# EAGLE design PRSC-2101-THCFM-1V3_eagle7 (EAGLE 9.5.0)
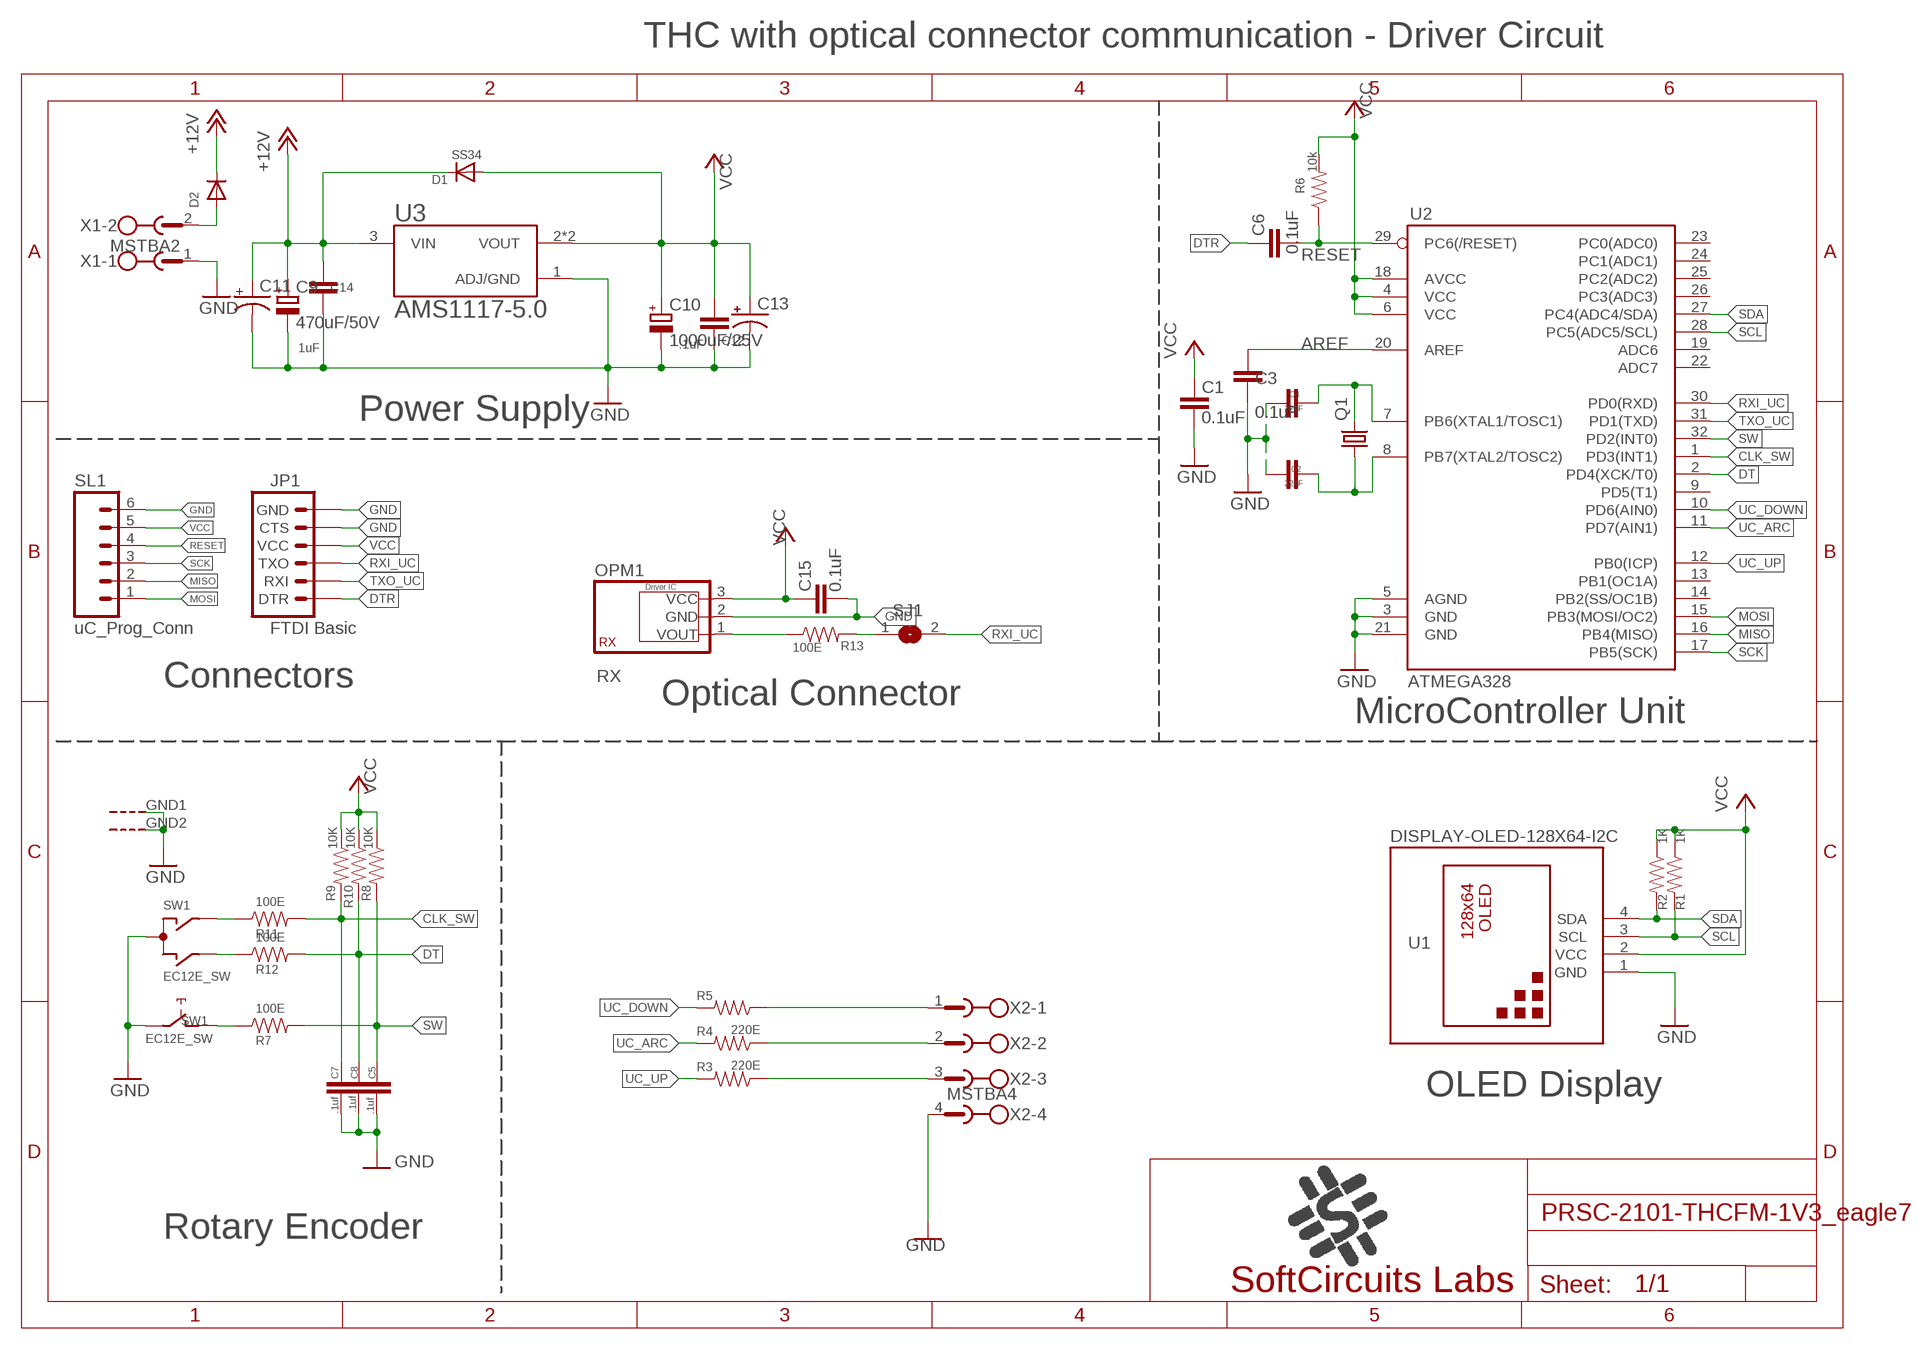
[diagram p0: schematic, sheet 1]

## Parts
C1  0.1uF  C-EUC1206  [C1206]
C2  22pF  C-EUC1206  [C1206]
C3  0.1uF  C-EUC1206  [C1206]
C4  22pF  C-EUC1206  [C1206]
C5  .1uf  C-EUC1206  [C1206]
C6  0.1uF  C-EUC1206  [C1206]
C7  .1uf  C-EUC1206  [C1206]
C8  .1uf  C-EUC1206  [C1206]
C9  470uF/50V  CPOL-EU153CLV-1010  [153CLV-1010]
C10  1000uF/25V  CPOL-EU153CLV-1010  [153CLV-1010]
C11  CAP_POL3528-KIT  [EIA3528-KIT]
C12  .1uF  CAP1206  [1206]
C13  CAP_POL3528-KIT  [EIA3528-KIT]
C14  1uF  CAP1206  [1206]
C15  0.1uF  C-EUC1206  [C1206]
D1  SS34  DIODESMA  [SMADIODE]
D2  DIODESMA  [SMADIODE]
JP1  FTDI Basic  ARDUINO_SERIAL_PROGRAMPTH  [1X06]
LOGO100  SC_LOGO  [SC_LOGO]
OPM1  RX  TOSLINK_DQR-025  [TOSLINK_DQ-025]
Q1  CRYSTALHC49UP  [HC49UP]
R1  1K  RESISTOR1206  [1206]
R2  1K  RESISTOR1206  [1206]
R3  220E  RESISTOR1206  [1206]
R4  220E  RESISTOR1206  [1206]
R5  220E  RESISTOR1206  [1206]
R6  10k  RESISTOR1206  [1206]
R7  100E  RESISTOR1206  [1206]
R8  10K  RESISTOR1206  [1206]
R9  10K  RESISTOR1206  [1206]
R10  10K  RESISTOR1206  [1206]
R11  100E  RESISTOR1206  [1206]
R12  100E  RESISTOR1206  [1206]
R13  100E  RESISTOR1206  [1206]
SJ1  SJ  [SJ]
SL1  uC_Prog_Conn  M06  [06P]
SW1  EC12E_SW  [ALPS_EC12E_SW]
U1  DISPLAY-OLED-128X64-I2C  [DISPLAY-OLED-128X64-I2C]
U2  ATMEGA328  ATMEGA168  [TQFP32-08]
U3  AMS1117-5.0  [SOT229P700X180-4N]
X1  MSTBA2  [MSTBA2]
X2  MSTBA4  [MSTBA4]

## Nets
+12V [power]: C9.+ C11.A(+) C14.1 D1.C D2.C U3.3(VIN)
AREF: C3.2 U2.20(AREF)
CLK_SW: C7.1 R9.2 R11.2 U2.1(PD3(INT1))
DT: C8.1 R10.2 R12.2 U2.2(PD4(XCK/T0))
DTR: C6.2 JP1.1(DTR)
GND: C1.1 C2.2 C3.1 C4.2 C5.2 C7.2 C8.2 C9.- C10.- C11.C(-) C12.2 C13.C(-) C14.2 C15.1 JP1.5(CTS) JP1.6(GND) OPM1.2(GND) SL1.6 SW1.C SW1.E SW1.GND1(G) SW1.GND2(G) U1.1(GND) U2.3(GND) U2.5(AGND) U2.21(GND) U3.1(ADJ/GND) X1.1 X2.4
MISO: SL1.2 U2.16(PB4(MISO))
MOSI: SL1.1 U2.15(PB3(MOSI/OC2))
N$1: R13.2 SJ1.1
N$2: R7.1 SW1.D
N$3: R12.1 SW1.B
N$5: R11.1 SW1.A
N$7: C4.1 Q1.2 U2.7(PB6(XTAL1/TOSC1))
N$8 [power]: D2.A X1.2
N$9: OPM1.1(VOUT) R13.1
N$10: C2.1 Q1.1 U2.8(PB7(XTAL2/TOSC2))
N$87: R5.1 X2.1
N$103: R3.1 X2.3
N$105: R4.1 X2.2
RESET: C6.1 R6.1 SL1.4 U2.29(PC6(/RESET))
RXI_UC: JP1.3(TXO) SJ1.2 U2.30(PD0(RXD))
SCK: SL1.3 U2.17(PB5(SCK))
SCL: R1.2 U1.3(SCL) U2.28(PC5(ADC5/SCL))
SDA: R2.2 U1.4(SDA) U2.27(PC4(ADC4/SDA))
SW: C5.1 R7.2 R8.2 U2.32(PD2(INT0))
TXO_UC: JP1.2(RXI) U2.31(PD1(TXD))
UC_ARC: R4.2 U2.11(PD7(AIN1))
UC_DOWN: R5.2 U2.10(PD6(AIN0))
UC_UP: R3.2 U2.12(PB0(ICP))
VCC: C1.2 C10.+ C12.1 C13.A(+) C15.2 D1.A JP1.4(VCC) OPM1.3(VCC) R1.1 R2.1 R6.2 R8.1 R9.1 R10.1 SL1.5 U1.2(VCC) U2.4(VCC) U2.6(VCC) U2.18(AVCC) U3.2(VOUT) U3.4(VOUT)
Unconnected: U2.9(PD5(T1)) U2.13(PB1(OC1A)) U2.14(PB2(SS/OC1B)) U2.19(ADC6) U2.22(ADC7) U2.23(PC0(ADC0)) U2.24(PC1(ADC1)) U2.25(PC2(ADC2)) U2.26(PC3(ADC3))

## Notes on the sheet
- THC with optical connector communication - Driver Circuit
- Power Supply
- Connectors
- Optical Connector
- MicroController Unit
- OLED Display
- Rotary Encoder
- SoftCircuits Labs

## Library data of the parts
C1-C8 C15 = SoftCircuits-Capacitors:C-EU: CAPACITOR, European symbol; SPICEPREFIX: C
C9 C10 = SoftCircuits-Capacitors:CPOL-EU: POLARIZED CAPACITOR, European symbol; SPICEPREFIX: C
C11 C13 = SparkFun-Capacitors:CAP_POL: Capacitor Polarized These are standard SMD and PTH capacitors. Normally 10uF, 47uF, and 100uF in electrolytic and tantalum varieties. Always verify the external diameter of the through hole cap, it varies with capacity, voltage, and manufacturer. The EIA devices should be standard.
C12 C14 = SparkFun-Capacitors:CAP: Capacitor Standard 0603 ceramic capacitor, and 0.1" leaded capacitor.
D1 D2 = adafruit:DIODE: Diode SMADIODE - SMA Surface Mount Package 20V 1A Schottky Diode Digikey: 641-1014-6-ND DO-1N4148 - Through Hole Small Current Diode SOD-123 20V 1 A (.5mV Vf) Schottky Diode - Digikey: MBRX120TPMSCT-ND SOD-323 10V 570mA (.38mV Vf, 3ns) Schottky Diode - Digikey: ZLLS410CT-ND SOD-523 30V 30mA Schottky Diode (RB751S-40TE61) - Digikey: RB751S-40TE61CT-ND SOT23-R/W - SOT23 Package (R = Solder Paste/Reflow Ovens, W = Hand-Soldering) BAT54Film 40V 300mA - Digikey: 497-7162-1-ND
JP1 = SparkFun:ARDUINO_SERIAL_PROGRAM
LOGO100 = _SoftCircuits_logo:SC_LOGO; SIZE: 150DPI
OPM1 = TOSLINK_Optical-modules:TOSLINK_DQR-025: DQR-025 General Purpose optical Receiving module
Q1 = adafruit:CRYSTAL: CRYSTAL; OC_FARNELL: unknown; OC_NEWARK: unknown
R1-R13 = SoftCircuits-Resistors:RESISTOR: Resistor Basic schematic elements and footprints for 0603, 1206, and PTH resistors.
SJ1 = jumper:SJ: SMD solder JUMPER
SL1 = con-amp-quick:M06: AMP QUICK CONNECTOR; OC_FARNELL: unknown; OC_NEWARK: unknown
SW1 = rotary-switch-alps:EC12E_SW: ALPS rotary Encoder EC12E series with switch; MPN: EC12E2424407; OC_FARNELL: 1520813; OC_NEWARK: 74M1068
U1 = diy-modules1.8:DISPLAY-OLED-128X64-I2C: 128x64 Dot Matrix OLED Module based on SSD1306 chip Variant with I2C interface More details available here: http://www.instructables.com/id/Monochrome-096-i2c-OLED-display-with-arduino-SSD13/ SSD1306 datasheet: https://cdn-shop.adafruit.com/datasheets/SSD1306.pdf Click here to find device on ebay.com <http://www.ebay.com/sch/oled+display+128x64+iic> Note: There are two variants: I2C and SPI. Search for the proper version.
U2 = SparkFun:ATMEGA168
U3 = AMS1117-5.0:AMS1117-5.0: Sot223/Pkg 1-Amp 5-Volt Low Drop Out Voltage Regulatator; AVAILABILITY: Unavailable; DESCRIPTION: Sot223/Pkg 1-Amp 5-Volt Low Drop Out Voltage Regulatator; MF: Advanced Monolithic Systems; MP: AMS1117-5.0; PACKAGE: None; PRICE: None
X1 = con-phoenix-508:MSTBA2: PHOENIX; MF: FARNELL; MPN: 1757242; OC_FARNELL: 3705171; OC_NEWARK: 71C4161
X2 = con-phoenix-508:MSTBA4: PHOENIX; MF: FARNELL; MPN: 1757268; OC_FARNELL: 3705195; OC_NEWARK: 71C4163

## Net classes
1 power: width 0.508 mm

## Board
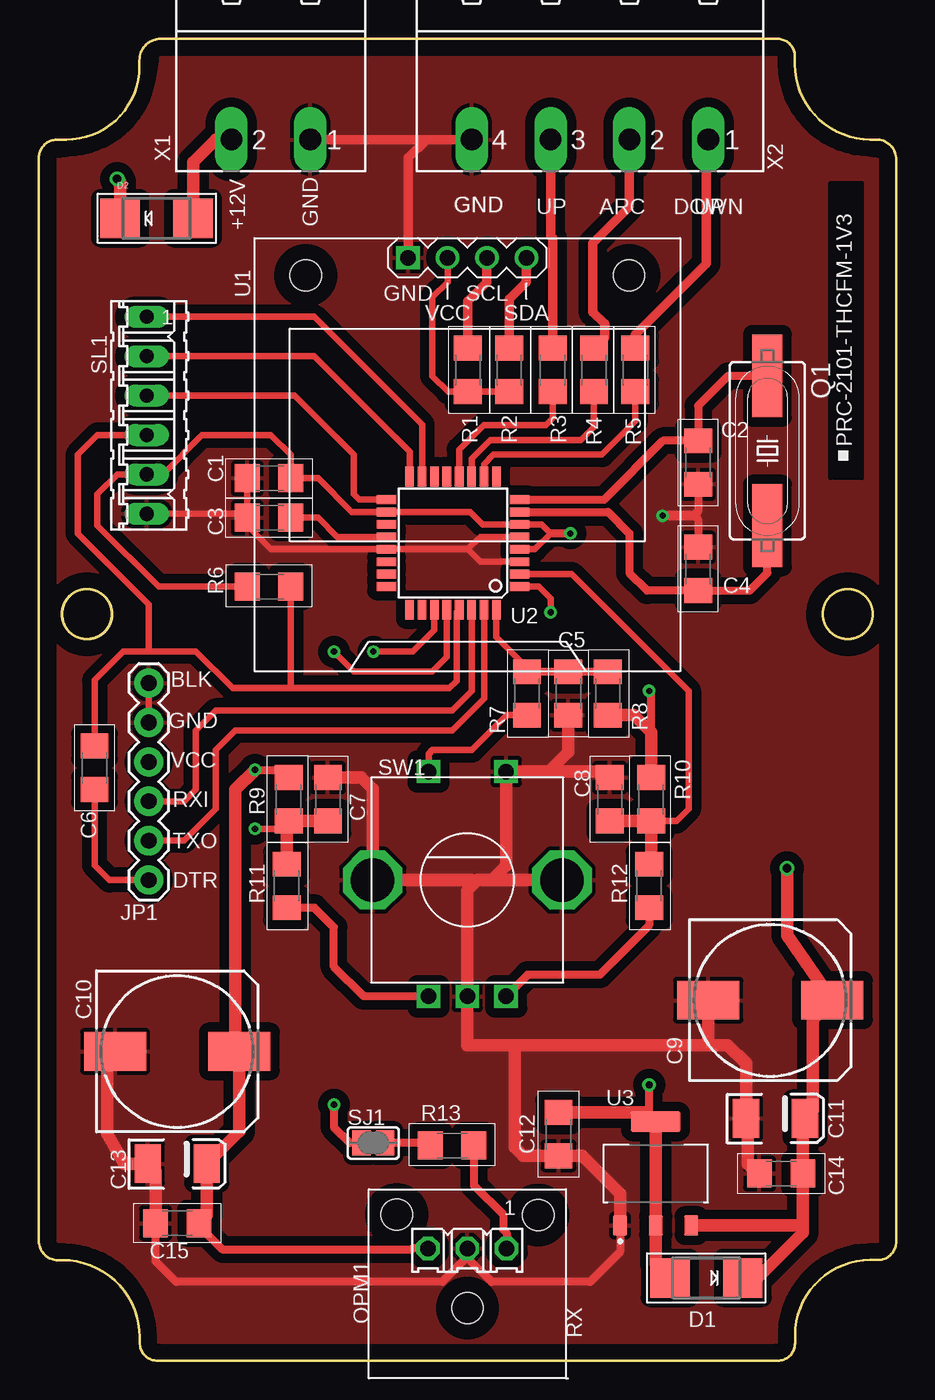
[diagram p1: board, top side]
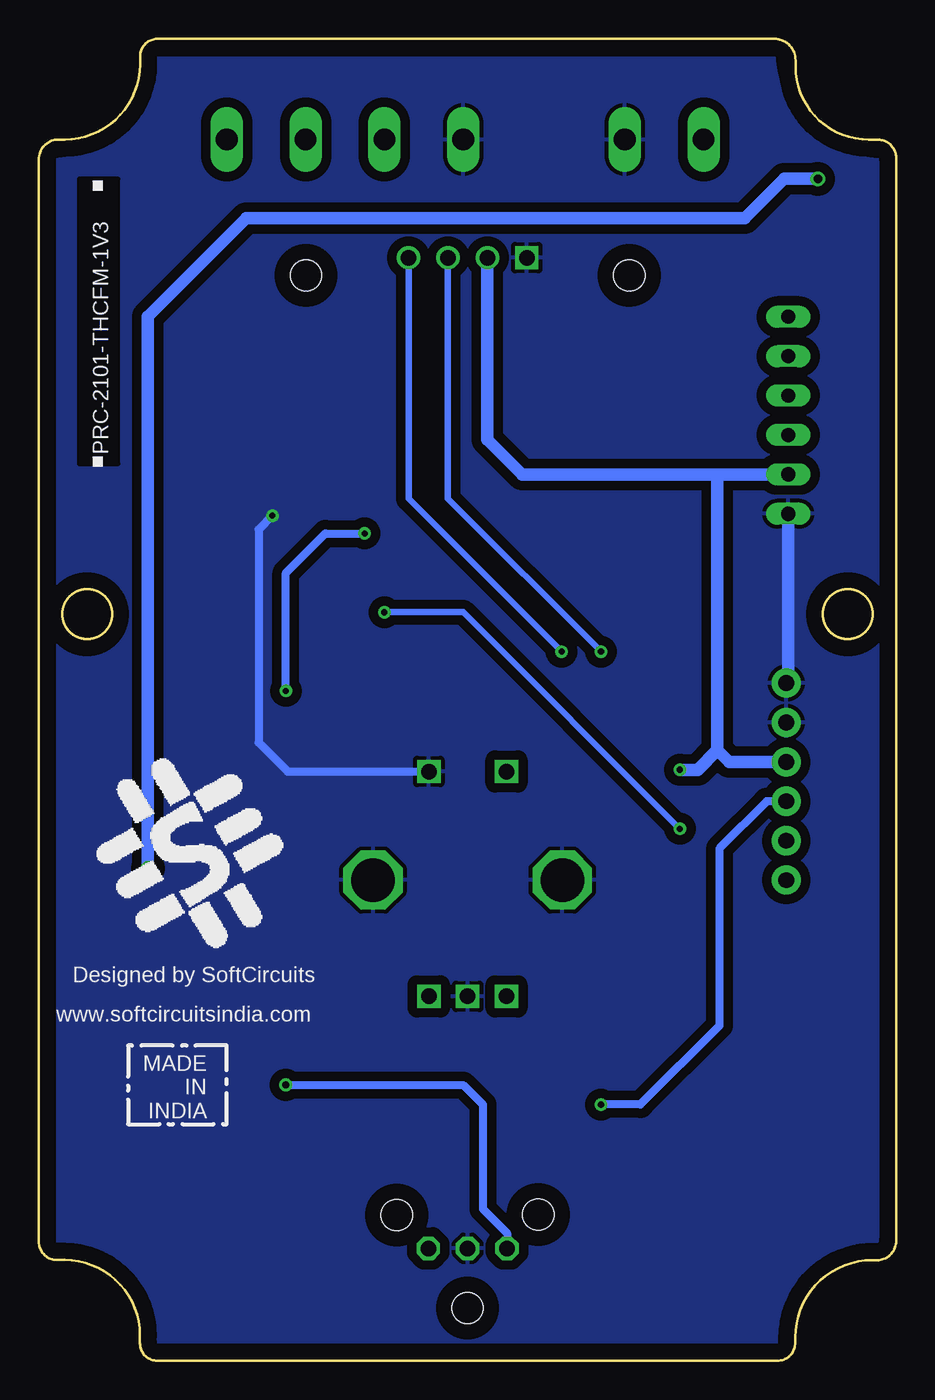
[diagram p2: board, bottom side, seen from below]

Size 55.27 x 85.25 mm. Coordinates in mm from the lower left corner, seen from the top.
Outline: 20.22,85.25 7.87,85.25 arc90 6.49,83.87 6.49,83.47 arc-90 1.76,78.74 1.19,78.74 arc90 0,77.56 0,7.72 arc90 1.23,6.48 1.52,6.48 arc-90 6.51,1.5 6.51,1.16 arc90 7.67,0 47.63,0 arc90 48.75,1.12 48.75,1.64 arc-90 53.6,6.5 54.09,6.5 arc90 55.27,7.67 55.27,77.47 arc90 53.99,78.75 53.59,78.75 arc-90 48.74,83.61 48.74,84.12 arc90 47.61,85.24 19.73,85.25
Outline: circle at 3.11,48.14 radius 1.6
Outline: circle at 52.15,48.14 radius 1.6
Copper layers (1*16): Top 0.035mm / dielectric 1.5mm / Bottom 0.035mm
Design rules "default": minimum track width 6mil, minimum drill 0.35mm, track to track 6mil, track to pad 6mil, pad to pad 6mil, via to via 6mil, smd to smd 6mil, copper to edge 40mil, drill to drill 6mil, minimum pad ring 10mil, minimum via ring 8mil, stop-mask expansion 4mil, vias tented up to drill 0mil, thermal gap 10mil
Holes 3.2 mm at 3.15,48.14 52.17,48.14

### Footprints (pad centres in the part's own frame; a part is rotated, then mirrored left to right if it is on the bottom)
C1206 = smd 1.6 x 1.8: 1 -1.4,0; 2 1.4,0
153CLV-1010 = smd 4 x 2.5: + 4,0; - -4,0
EIA3528-KIT = smd 1.7 x 2.5: A 1.9,0; C -1.9,0
1206 = smd 1.6 x 1.8: 1 -1.4,0; 2 1.4,0
SMADIODE = smd 2.54 x 2.54: A 2.349,0; C -2.349,0
1X06 = drill 1.016 pad 1.88: 1 0,0; 2 2.54,0; 3 5.08,0; 4 7.62,0; 5 10.16,0; 6 12.7,0
TOSLINK_DQ-025 = drill 1 octagon: 1 2.54,6.35; 2 0,6.35; 3 -2.54,6.35 | hole 2: -4.547,8.534; 4.572,8.509; 0,2.515
HC49UP = smd 5.334 x 1.93: 1 -4.826,0; 2 4.826,0
SJ = smd 1.168 x 1.6: 1 -0.762,0; 2 0.762,0
06P = drill 0.914 long: 1 -6.35,0; 2 -3.81,0; 3 -1.27,0; 4 1.27,0; 5 3.81,0; 6 6.35,0
ALPS_EC12E_SW = drill 1 square: A -2.5,-7.5; B 2.5,-7.5; C 0,-7.5; D -2.5,7; E 2.5,7 | drill 2.8 octagon: GND1 -6.1,0; GND2 6.1,0
DISPLAY-OLED-128X64-I2C = drill 1 square: 1 -3.81,12.7 | drill 1: 2 -1.27,12.7; 3 1.27,12.7; 4 3.81,12.7 | hole 2: -10.414,11.557; 10.414,11.557
TQFP32-08 = smd 1.27 x 0.559: 1 -4.293,2.8; 2 -4.293,2; 3 -4.293,1.2; 4 -4.293,0.4; 5 -4.293,-0.4; 6 -4.293,-1.2; 7 -4.293,-2; 8 -4.293,-2.8; 17 4.293,-2.8; 18 4.293,-2; 19 4.293,-1.2; 20 4.293,-0.4; 21 4.293,0.4; 22 4.293,1.2; 23 4.293,2; 24 4.293,2.8 | smd 0.559 x 1.27: 9 -2.8,-4.293; 10 -2,-4.293; 11 -1.2,-4.293; 12 -0.4,-4.293; 13 0.4,-4.293; 14 1.2,-4.293; 15 2,-4.293; 16 2.8,-4.293; 25 2.8,4.293; 26 2,4.293; 27 1.2,4.293; 28 0.4,4.293; 29 -0.4,4.293; 30 -1.2,4.293; 31 -2,4.293; 32 -2.8,4.293
SOT229P700X180-4N = smd 0.93 x 1.31: 1 -2.29,-3.345; 2 0,-3.345; 3 2.29,-3.345 | smd 3.24 x 1.31: 4 0,3.345
MSTBA2 = drill 1.397 long: 1 -2.54,5.08; 2 2.54,5.08
MSTBA4 = drill 1.397 long: 1 -7.62,5.08; 2 -2.54,5.08; 3 2.54,5.08; 4 7.62,5.08

### Placement (x,y rotation side)
C1  14.83,56.9 0 top
C2  42.5,57.92 270 top
C3  14.83,54.36 0 top
C4  42.5,51.06 90 top
C5  34.14,43.03 270 top
C6  3.59,38.23 270 top
C7  18.64,36.2 90 top
C8  36.8,36.2 90 top
C9  47.15,23.25 0 top
C10  8.93,19.95 0 top
C11  47.49,15.63 0 top
C12  33.5,14.61 270 top
C13  8.93,12.71 0 top
C14  47.86,12.07 180 top
C15  8.93,8.87 0 top
D1  43.03,5.34 180 top
D2  7.59,73.67 0 top
JP1  7.09,31 90 top
LOGO100  45.07,33.03 180 bottom
OPM1  27.62,0.9 0 top
Q1  46.96,58.68 270 top
R1  27.66,63.89 90 top
R2  30.33,63.89 90 top
R3  33.12,63.89 270 top
R4  35.79,63.89 270 top
R5  38.45,63.89 270 top
R6  14.83,49.92 180 top
R7  31.47,43.03 90 top
R8  36.68,43.03 90 top
R9  16.1,36.2 270 top
R10  39.47,36.2 270 top
R11  15.98,30.61 90 top
R12  39.34,30.61 90 top
R13  26.64,13.88 180 top
SJ1  21.56,14.04 180 top
SL1  6.96,60.97 270 top
SW1  27.62,31 0 top
U1  27.62,58.43 0 top
U2  26.7,52.73 180 top
U3  39.76,12.07 0 top
X1  14.96,83.83 180 top
X2  35.53,83.83 180 top

### Tracks (layer width: path | path; a pad name or v marks a point on that pad's centre or on a via)
+12V  (via drill 0.55)
  Top 0.813: v48.23,31.76 48.23,27.44 C9.+ 49.88,21.98 49.88,16.12 C11.A 49.26,15.5 C14.1 49.26,8.9 | D1.C 46.34,5.34 49.26,8.26 49.26,8.9 | U3.3 49.09,8.73 49.26,8.9 | D2.C 5.25,76.02 v5.05,76.21
  Bottom 0.813: v48.23,31.76 48.23,67.32 41.88,73.67 9.75,73.67 7.21,76.21 v5.05,76.21
AREF
  Top 0.406: U2.20 19.25,53.13 18.01,54.36 C3.2
CLK_SW  (via drill 0.4)
  Top 0.406: U2.1 32.22,49.93 32.99,49.16 v32.99,48.27 | 15.98,34.3 v13.94,34.3
  Top 0.813: C7.1 R9.2 15.98,34.67 15.98,34.3 R11.2
  Bottom 0.406: v32.99,48.27 27.91,48.27 v13.94,34.3
DT
  Top 0.406: U2.2 34.34,50.73 41.88,43.19 41.88,35.57 41.12,34.8 R10.2
  Top 0.813: C8.1 R10.2 39.47,32.14 R12.2
DTR
  Top 0.406: JP1.1 4.55,31 3.59,31.95 C6.2
GND  (via drill 0.4)
  Top 0.406: JP1.6 JP1.5 | SL1.6 13.43,54.62 C1.1 C3.1 13.43,53.86 14.96,52.33 U2.21 27.66,52.33 | U2.3 28.46,51.53 27.66,52.33 | U2.5 28.46,53.13 27.66,52.33
  Top 0.508: 40.28,54.49 v40.21,54.49 | 7.53,10.17 7.53,6.42 8.86,5.09 26.01,5.09 27.62,6.7 OPM1.2 27.62,6.65 29.18,5.09 35.53,5.09 37.47,7.03 U3.1 | C2.2 42.5,54.74 42.37,54.62 | 42.25,54.49 42.5,54.24 C4.2
  Top 0.61: 42.37,54.62 42.25,54.49 v40.21,54.49 | C4.2 42.24,52.46 | U1.1 23.81,77.57 24.99,78.75 | X1.1 24.99,78.75 | 24.99,78.75 X2.4
  Top 0.813: C5.2 34.14,39.25 32.88,37.99 | 32.88,37.99 SW1.E 30.12,31.93 29.18,30.99 | C8.2 36.42,37.99 32.89,37.99 32.88,37.99 | C7.2 20.8,37.6 21.52,36.88 SW1.GND1 27.86,31 28.28,30.97 | 29.18,30.99 28.3,30.99 28.28,30.97 | 28.28,30.97 27.62,30.32 SW1.C 27.62,20.33 30.67,20.33 | C14.2 46.33,12.07 45.69,12.71 45.69,15.52 C11.C 45.59,19.16 44.42,20.33 43.15,20.33 | U3.1 37.47,10.77 35.03,13.21 C12.2 31.22,13.21 30.67,13.76 30.67,20.33 | 43.15,20.33 30.67,20.33 | C9.- 43.15,20.33 | C10.- 4.42,19.44 4.42,14.62 5.5,12.71 C13.C 7.53,12.21 7.53,10.17 C15.1 | SW1.GND2 29.18,30.99
  Bottom 0.508: v40.21,54.49 41.1,53.6 41.1,39.87 39.23,37.99 SW1.E
  Bottom 0.813: SL1.6 6.96,43.82 JP1.6
  pour Top (isolate 0.61): 0.86,7.12 arc-90 7.34,0.64 47.85,0.64 arc-90 54.58,7.37 54.58,77.48 arc-90 47.6,84.46 7.85,84.46 arc-90 0.86,77.48
  pour Bottom (isolate 0.61): 0.86,7.12 arc-90 7.34,0.64 47.85,0.64 arc-90 54.58,7.37 54.58,77.48 arc-90 47.6,84.46 7.85,84.46 arc-90 0.86,77.48
MISO
  Top 0.406: SL1.2 17.75,64.78 23.9,58.63 U2.16
MOSI
  Top 0.406: U2.15 24.7,60.37 17.75,67.32 SL1.1
N$1
  Top 0.508: R13.2 25.09,14.04 SJ1.1
N$2
  Top 0.406: SW1.D 25.12,39.12 25.37,39.38 27.91,39.38 30.16,41.63 R7.1
N$3
  Top 0.508: R12.1 39.34,28.07 36.16,24.89 31.52,24.89 SW1.B
N$4
  cutout Bottom: 52.68,76.21 52.68,57.83 50.14,57.83 50.14,76.21
N$5
  Top 0.508: SW1.A 20.94,23.5 19.02,25.41 19.02,27.95 17.76,29.21 R11.1
N$6
  cutout Top: 51.03,56.9 51.03,75.95 53.06,75.95 53.06,56.9
N$7
  Top 0.508: U2.7 36.69,54.73 38.07,53.35 38.07,50.81 39.22,49.66 C4.1 45.82,49.66 46.96,50.81 Q1.2
N$8
  Top 0.813: X1.2 11.4,78.75 9.94,77.29 D2.A
N$9
  Top 0.508: R13.1 28.04,11.31 29.92,9.43 29.92,8.46 30.16,8.23 OPM1.1
N$10
  Top 0.508: U2.8 36.44,55.53 40.24,59.32 C2.1 42.5,61.58 44.42,63.51 Q1.1
N$87
  Top 0.61: R5.1 38.45,66.17 43.03,70.75 43.03,78.62 X2.1
N$103
  Top 0.61: R3.1 33.12,72.4 32.99,72.52 X2.3
N$105
  Top 0.61: R4.1 36.48,65.98 36.48,66.86 35.71,67.63 35.71,72.07 38.07,74.43 X2.2
RESET
  Top 0.406: U2.29 26.94,48.27 26.94,43.84 26.46,43.37 16.23,43.37 | 16.23,43.37 12.49,43.37 10.13,45.73 7.09,45.73 | 7.09,45.73 5.44,45.73 3.59,43.89 C6.1 | R6.1 16.23,43.37 | SL1.4 3.78,59.7 2.51,58.43 2.51,53.35 7.09,48.77 7.09,45.73
RXI_UC  (via drill 0.4)
  Top 0.406: U2.30 27.9,43.18 26.64,41.92 11.4,41.92 10.13,40.65 10.13,36.84 9.37,36.07 JP1.3
  Top 0.508: SJ1.2 20.04,14.04 19.02,15.06 v19.02,16.52
  Bottom 0.508: JP1.3 8.36,36.07 11.4,33.03 11.4,21.6 16.48,16.52 v19.02,16.52
SCK
  Top 0.406: SL1.3 16.48,62.24 20.29,58.43 20.29,55.89 20.66,55.53 U2.17
SCL  (via drill 0.4)
  Top 0.406: U2.28 26.3,45.39 25.37,44.46 20.29,44.46 v19.02,45.73
  Top 0.61: U1.3 28.89,69.57 27.66,68.33 R1.2
  Bottom 0.406: U1.3 28.89,55.59 v19.02,45.73
SDA  (via drill 0.4)
  Top 0.406: U2.27 25.5,47.13 24.1,45.73 v21.56,45.73
  Top 0.61: U1.4 31.43,69.57 30.33,68.46 R2.2
  Bottom 0.406: v21.56,45.73 31.43,55.59 U1.4
SW
  Top 0.406: U2.32 29.5,46.68 31.47,44.71 R7.2
  Top 0.508: R8.2 C5.1 R7.2
TXO_UC
  Top 0.406: U2.31 28.7,42.71 26.64,40.65 12.67,40.65 11.4,39.38 11.4,35.57 9.37,33.53 JP1.2
UC_ARC
  Top 0.406: U2.11 27.9,58.16 29.11,59.37 34.95,59.37 35.79,60.2 R4.2
UC_DOWN
  Top 0.406: U2.10 28.7,57.82 29.31,58.43 36.3,58.43 38.45,60.59 R5.2
UC_UP
  Top 0.406: U2.12 27.1,58.76 28.68,60.33 32.68,60.33 33.12,60.77 R3.2
VCC  (via drill 0.4, 0.45)
  Top 0.406: R2.1 R1.1 26.39,62.49 25.37,63.51 25.37,68.59 26.35,69.57 U1.2 | U2.4 31.97,52.33 32.99,53.35 32.41,53.93 U2.6 28.61,53.93 27.8,54.73 U2.18 20.18,54.73 18.01,56.9 C1.2 16.23,58.43 14.96,59.7 10.52,59.7 7.97,57.16 SL1.5 5.05,57.16 3.78,55.89 3.78,53.85 7.72,49.92 R6.2
  Top 0.508: v13.94,38.11 15.6,38.11 R9.1 | 39.47,40.52 39.47,43.06 v39.34,43.19 | v34.26,53.35 32.99,53.35 | OPM1.3 24.1,7.25 24.02,7.16 11.87,7.16 10.33,8.7 C15.2 | U3.4 39.34,15.84 v39.34,17.79
  Top 0.813: R8.1 38.36,41.63 39.47,40.52 R10.1 | D1.A 39.76,6.25 U3.2 U3.4 39.17,16.01 C12.1 | C15.2 10.83,9.37 C13.A 12.93,14.81 C10.+ 12.67,20.2 12.67,36.84 v13.94,38.11
  Bottom 0.508: v39.34,43.19 39.34,50.81 36.8,53.35 v34.26,53.35 | 11.34,57.09 11.28,57.16 | v39.34,17.79 27.91,17.79 26.64,16.52 26.64,9.79 25.08,8.23 OPM1.3
  Bottom 0.813: SL1.5 11.28,57.16 24.1,57.16 26.35,59.41 U1.2 | 11.53,39.38 10.77,38.61 JP1.4 | 11.53,39.38 11.53,56.9 11.34,57.09 | v13.94,38.11 12.8,38.11 11.53,39.38

### Text on the board
tPlace: +12V | GND | GND | GND | UP | ARC | UP | DOWN | PRC-2101-THCFM-1V3 | BLK | GND | VCC | RXI | TXO | DTR | RX
bPlace: PRC-2101-THCFM-1V3 | Designed by SoftCircuits | www.softcircuitsindia.com | MADE / IN / INDIA
_tNames: X2 | X1 | D2 | U1 | SL1 | Q1 | R1 | R2 | R3 | R4 | R5 | C2 | C1 | C3 | R6 | U2 | C4 | C5 | R8 | R7 | R10 | SW1 | C7 | C8 | C6 | R9 | JP1 | R11 | R12 | C10 | C9 | C11 | U3 | SJ1 | R13 | C12 | C14 | C13 | C15 | OPM1 | D1